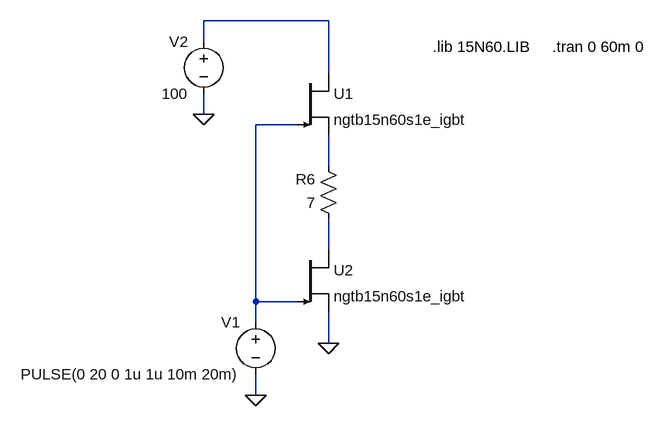
[diagram p0: schematic ponte h comum.asc]
ponte h comum.asc, the LTspice schematic file:
Version 4
SHEET 1 2740 1556
WIRE 2048 432 1856 432
WIRE 1856 464 1856 432
WIRE 2048 512 2048 432
WIRE 1856 576 1856 544
WIRE 2000 592 1936 592
WIRE 2048 656 2048 608
WIRE 2048 784 2048 736
WIRE 1936 864 1936 592
WIRE 2000 864 1936 864
WIRE 1936 896 1936 864
WIRE 2048 928 2048 880
WIRE 1936 1008 1936 976
FLAG 1936 1008 0
FLAG 1856 576 0
FLAG 2048 928 0
SYMBOL voltage 1936 880 M0
WINDOW 123 0 0 Left 2
WINDOW 39 0 0 Left 2
SYMATTR InstName V1
SYMATTR Value PULSE(0 20 0 1u 1u 10m 20m)
SYMBOL res 2064 752 R180
WINDOW 0 36 76 Left 2
WINDOW 3 36 40 Left 2
SYMATTR InstName R6
SYMATTR Value 7
SYMATTR SpiceLine tol=1 pwr=100
SYMBOL voltage 1856 448 M0
WINDOW 123 0 0 Left 2
WINDOW 39 0 0 Left 2
SYMATTR InstName V2
SYMATTR Value 100
SYMBOL Misc\\nigbt 2000 784 R0
SYMATTR InstName U2
SYMATTR Value ngtb15n60s1e_igbt
SYMBOL Misc\\nigbt 2000 512 R0
SYMATTR InstName U1
SYMATTR Value ngtb15n60s1e_igbt
TEXT 2392 472 Left 2 !.tran 0 60m 0
TEXT 2208 472 Left 2 !.lib 15N60.LIB

The netlist it stands for:
* ponte h comum.asc
V1 N002 0 PULSE(0 20 0 1u 1u 10m 20m)
R6 N004 N003 7 tol=1 pwr=100
V2 N001 0 100
Z§U2 N004 N002 0 ngtb15n60s1e_igbt
Z§U1 N001 N002 N003 ngtb15n60s1e_igbt
.tran 0 60m 0
.lib 15N60.LIB
.backanno
.end